# Altium project usbTosata_V1.1.PrjPCB
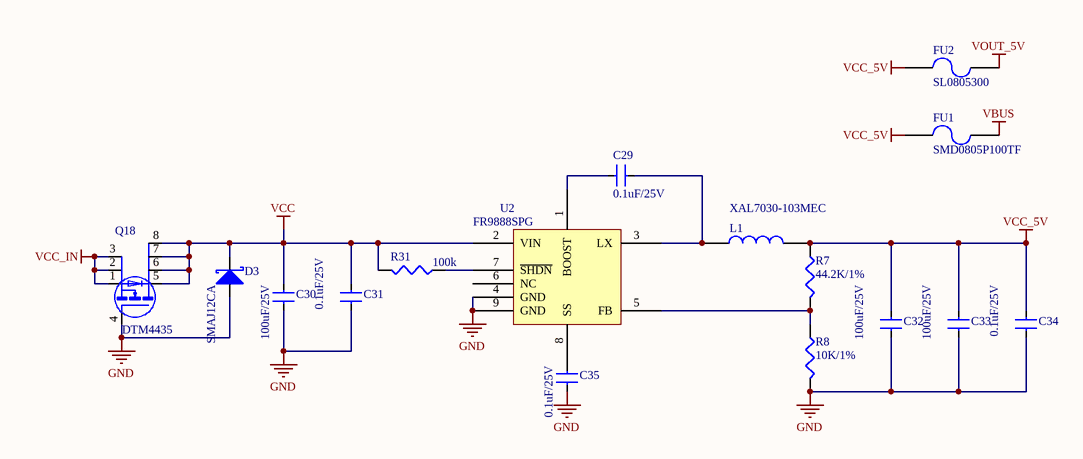
[diagram p0: power.SchDoc]
2 sheets, 31 parts. Net scope: global (net labels, ports and power ports of the same name join across sheets).
Board file: PCB1.PcbDoc
Sheets:
  power.SchDoc
  CONNECTOR.SchDoc

## Sheet power.SchDoc
size A4

### Parts
C29  0.1uF/25V  [0603C]
C30  100uF/25V  [1210C]
C31  0.1uF/25V  [0603C]
C32  100uF/25V  [1210C]
C33  100uF/25V  [1210C]
C34  0.1uF/25V  [0603C]
C35  0.1uF/25V  [0603C]
D3  SMAJ12CA  [SMA]
FU1  SMD0805P100TF  [F0805]
FU2  SL0805300  [F0805]
L1  XAL7030-103MEC  [XAL7030]
Q18  DTM4435  [SO-8]
R7  44.2K/1%  [0603R]
R8  10K/1%  [0603R]
R31  100k  [0603R]
U2  FR9888SPG  [SOP120P600-8N]

### Nets
GND: C30.2 C31.2 C32.2 C33.2 C34.2 C35.2 D3.1(A) Q18.4(G) R8.2 U2.4(GND) U2.9(GND)
VBUS: FU1.2
VCC: C30.1 C31.1 D3.2(K) Q18.5(D) Q18.6(D) Q18.7(D) Q18.8(D) R31.2 U2.2(VIN)
VCC_5V: C32.1 C33.1 C34.1 FU1.1 FU2.1 L1.2 R7.1
VCC_IN: Q18.1(S) Q18.2(S) Q18.3(S)
VOUT_5V: FU2.2
NetC29_1: C29.1 U2.1(BOOST)
NetC29_2: C29.2 L1.1 U2.3(LX)
NetC35_1: C35.1 U2.8(SS)
NetR7_2: R7.2 R8.1 U2.5(FB)
NetR31_1: R31.1 U2.7(~{SHDN})

Not connected (* = marked no-connect by the designer): U2 6(NC)

### Library data of the parts
C29-C35 = 0.01UF: CCX85-103
D3 = DIODE S: Schottky Diode
FU1 FU2 = FUSE2: Fuse
L1 = INDUCTOR
Q18 = Si4004DY
R7 R8 R31 = Res3: Resistor; Published: 8-Jun-2000; LatestRevisionDate: 29-May-2009; LatestRevisionNote: IPC-7351 Footprint Added.; PackageReference: J1-0603; Publisher: Altium Limited; PackageDescription: Chip Resistor

## Sheet CONNECTOR.SchDoc
size A4
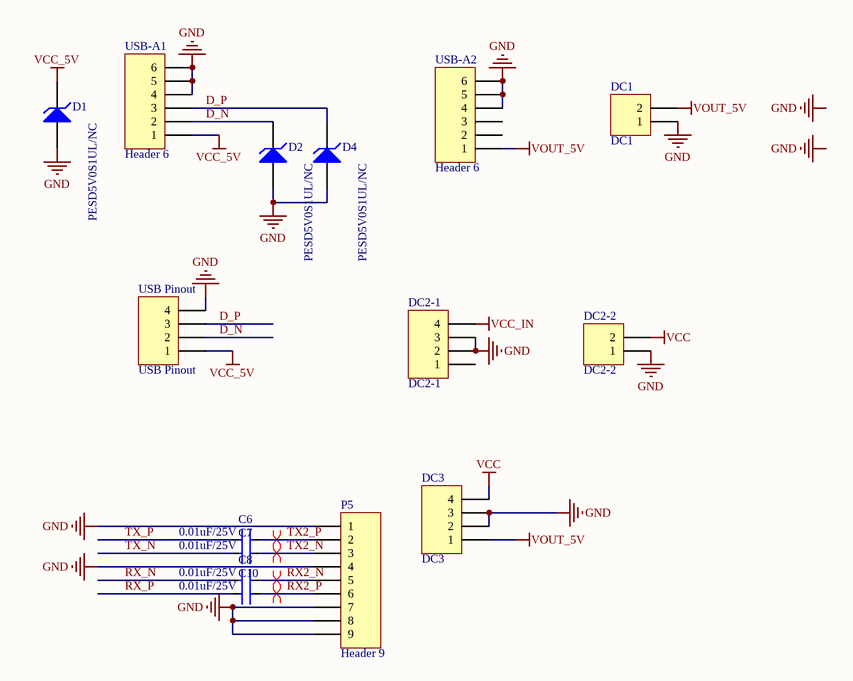
[diagram p1: CONNECTOR.SchDoc]

### Parts
C6  0.01uF/25V  [0603C]
C7  0.01uF/25V  [0603C]
C8  0.01uF/25V  [0603C]
C10  0.01uF/25V  [0603C]
D1  PESD5V0S1UL/NC  [0402R]
D2  PESD5V0S1UL/NC  [0402R]
D4  PESD5V0S1UL/NC  [0402R]
DC1  DC1  [2X2MMZ]
DC2-1  DC2-1  [DC005]
DC2-2  DC2-2  [2X2MMZ]
DC3  DC3  [2X4MMZ]
P5  Header 9  [SATA 7P]
USB-A1  Header 6  [USB-A-C]
USB-A2  Header 6  [USB-A-C]
USB_Pinout  USB Pinout  [sip-4l]

### Nets
GND: D1.1(A) D2.1(A) D4.1(A) DC1.1 DC2-1.2 DC2-1.3 DC2-2.1 DC3.2 DC3.3 P5.1 P5.4 P5.7 P5.8 P5.9 USB-A1.4 USB-A1.5 USB-A1.6 USB-A2.4 USB-A2.5 USB-A2.6 USB_Pinout.4
VCC: DC2-2.2 DC3.4
VCC_5V: D1.2(K) USB-A1.1 USB_Pinout.1
VCC_IN: DC2-1.4
VOUT_5V: DC1.2 DC3.1 USB-A2.1
D_N: D2.2(K) USB-A1.2 USB_Pinout.2
D_P: D4.2(K) USB-A1.3 USB_Pinout.3
RX2_N: C8.2 P5.5
RX2_P: C10.2 P5.6
RX_N: C8.1
RX_P: C10.1
TX2_N: C7.2 P5.3
TX2_P: C6.2 P5.2
TX_N: C7.1
TX_P: C6.1

Not connected (* = marked no-connect by the designer): DC2-1 1; USB-A2 2 3

### Layout directives
differential pair: RX2_N, RX2_P, TX2_N, TX2_P

### Notes on the sheet
- Labels drawn without touching a wire or pin: GND

### Library data of the parts
C6-C8 C10 = 0.01UF: CCX85-103
D1 D2 D4 = D Zener: Zener Diode; Published: 8-Jun-2000; LatestRevisionDate: 17-Jul-2002; LatestRevisionNote: Re-released for DXP Platform.; PackageReference: DIODE-0.7; Publisher: Altium Limited
DC1 DC2-2 = Header 2: Header, 2-Pin; LatestRevisionDate: 17-Jul-2002; LatestRevisionNote: Re-released for DXP Platform.; Publisher: Altium Limited
DC2-1 DC3 USB_Pinout = Header 4: Header, 4-Pin; LatestRevisionDate: 17-Jul-2002; LatestRevisionNote: Re-released for DXP Platform.; Publisher: Altium Limited
P5 = Header 9: Header, 9-Pin; LatestRevisionDate: 17-Jul-2002; LatestRevisionNote: Re-released for DXP Platform.; Publisher: Altium Limited
USB-A1 USB-A2 = Header 6: Header, 6-Pin; LatestRevisionDate: 17-Jul-2002; LatestRevisionNote: Re-released for DXP Platform.; Publisher: Altium Limited

## Nets that join several sheets
GND: power (11 pins), CONNECTOR (21 pins)
VCC: power (9 pins), CONNECTOR (DC2-2.2 DC3.4)
VCC_5V: power (7 pins), CONNECTOR (D1.2 USB-A1.1 USB_Pinout.1)
VCC_IN: power (Q18.1 Q18.2 Q18.3), CONNECTOR (DC2-1.4)
VOUT_5V: power (FU2.2), CONNECTOR (DC1.2 DC3.1 USB-A2.1)